# Altium project LCD_controller_hv2.PrjPcb
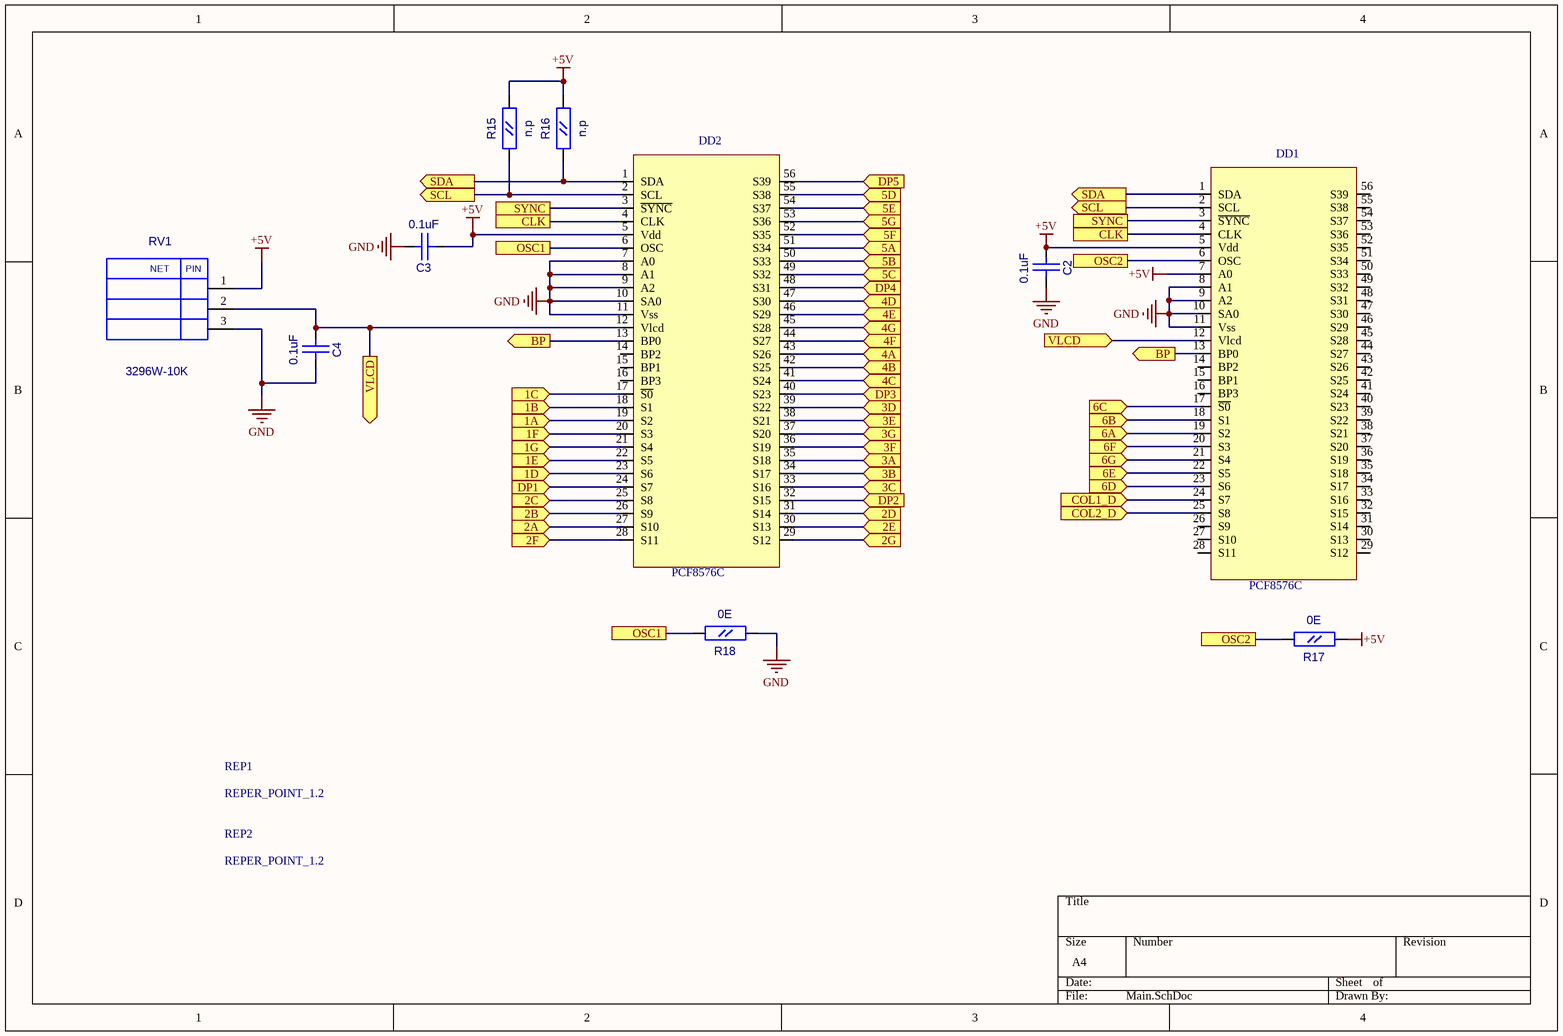
[diagram p0: Main.SchDoc]
4 sheets, 40 parts. Net scope: flat (ports and power ports of the same name join across sheets).
Board file: LCD_controller_hv2.PcbDoc
Sheets:
  Main.SchDoc
  LCD.SchDoc
  Connections.SchDoc
  Heater.SchDoc

## Sheet Main.SchDoc
size A4

### Parts
C2  0.1uF  [CC0603]
C3  0.1uF  [CC0603]
C4  0.1uF  [CC0603]
DD1  PCF8576C  [SOT190-1]
DD2  PCF8576C  [SOT190-1]
R15  n.p  [RC0603]
R16  n.p  [RC0603]
R17  0E  [RC0603]
R18  0E  [RC0603]
REP1  REPER_POINT_1.2  [REPER1.2]
REP2  REPER_POINT_1.2  [REPER1.2]
RV1  3296W-10K  [PLS-03]

### Ports
1A (in), 1B (in), 1C (in), 1D (in), 1E (in), 1F (in), 1G (in), 2A (in), 2B (in), 2C (in), 2D (in), 2E (in), 2F (in), 2G (in), 3A (in), 3B (in), 3C (in), 3D (in), 3E (in), 3F (in), 3G (in), 4A (in), 4B (in), 4C (in), 4D (in), 4E (in), 4F (in), 4G (in), 5A (in), 5B (in), 5C (in), 5D (in), 5E (in), 5F (in), 5G (in), 6A (in), 6B (in), 6C (in), 6D (in), 6E (in), 6F (in), 6G (in), BP (out), CLK, COL1_D (in), COL2_D (in), DP1 (in), DP2 (in), DP3 (in), DP4 (in), DP5 (in), OSC1, OSC2, SCL (out), SDA (out), SYNC, VLCD (in), VLCD (out)

### Nets
+5V: C2.1(A) C3.1(A) DD1.5(Vdd) DD1.7(A0) DD2.5(Vdd) R15.2(B) R16.2(B) R17.1(A) RV1.1
GND: C2.2(B) C3.2(B) C4.2(B) DD1.8(A1) DD1.9(A2) DD1.10(SA0) DD1.11(Vss) DD2.7(A0) DD2.8(A1) DD2.9(A2) DD2.10(SA0) DD2.11(Vss) R18.1(A) RV1.3
1A: DD2.19(S2) ; port 1A
1B: DD2.18(S1) ; port 1B
1C: DD2.17(~{S0}) ; port 1C
1D: DD2.23(S6) ; port 1D
1E: DD2.22(S5) ; port 1E
1F: DD2.20(S3) ; port 1F
1G: DD2.21(S4) ; port 1G
2A: DD2.27(S10) ; port 2A
2B: DD2.26(S9) ; port 2B
2C: DD2.25(S8) ; port 2C
2D: DD2.31(S14) ; port 2D
2E: DD2.30(S13) ; port 2E
2F: DD2.28(S11) ; port 2F
2G: DD2.29(S12) ; port 2G
3A: DD2.35(S18) ; port 3A
3B: DD2.34(S17) ; port 3B
3C: DD2.33(S16) ; port 3C
3D: DD2.39(S22) ; port 3D
3E: DD2.38(S21) ; port 3E
3F: DD2.36(S19) ; port 3F
3G: DD2.37(S20) ; port 3G
4A: DD2.43(S26) ; port 4A
4B: DD2.42(S25) ; port 4B
4C: DD2.41(S24) ; port 4C
4D: DD2.47(S30) ; port 4D
4E: DD2.46(S29) ; port 4E
4F: DD2.44(S27) ; port 4F
4G: DD2.45(S28) ; port 4G
5A: DD2.51(S34) ; port 5A
5B: DD2.50(S33) ; port 5B
5C: DD2.49(S32) ; port 5C
5D: DD2.55(S38) ; port 5D
5E: DD2.54(S37) ; port 5E
5F: DD2.52(S35) ; port 5F
5G: DD2.53(S36) ; port 5G
6A: DD1.19(S2) ; port 6A
6B: DD1.18(S1) ; port 6B
6C: DD1.17(~{S0}) ; port 6C
6D: DD1.23(S6) ; port 6D
6E: DD1.22(S5) ; port 6E
6F: DD1.20(S3) ; port 6F
6G: DD1.21(S4) ; port 6G
BP: DD1.13(BP0) DD2.13(BP0) ; port BP
COL1: DD1.24(S7) ; port COL1_D
COL2: DD1.25(S8) ; port COL2_D
DP: DD2.24(S7) ; port DP1
DP2: DD2.32(S15) ; port DP2
DP3: DD2.40(S23) ; port DP3
DP4: DD2.48(S31) ; port DP4
DP5: DD2.56(S39) ; port DP5
NetC4_1: C4.1(A) DD1.12(Vlcd) DD2.12(Vlcd) RV1.2 ; port VLCD
NetDD1_1: DD1.1(SDA) DD2.1(SDA) R16.1(A) ; port SDA
NetDD1_2: DD1.2(SCL) DD2.2(SCL) R15.1(A) ; port SCL
NetDD1_3: DD1.3(~{SYNC}) DD2.3(~{SYNC}) ; port SYNC
NetDD1_4: DD1.4(CLK) DD2.4(CLK) ; port CLK
NetDD1_6: DD1.6(OSC) R17.2(B) ; port OSC2
NetDD2_6: DD2.6(OSC) R18.2(B) ; port OSC1

Not connected (* = marked no-connect by the designer): DD1 14(BP2) 15(BP1) 16(BP3) 26(S9) 27(S10) 28(S11) 29(S12) 30(S13) 31(S14) 32(S15) 33(S16) 34(S17) 35(S18) 36(S19) 37(S20) 38(S21) 39(S22) 40(S23) 41(S24) 42(S25) 43(S26) 44(S27) 45(S28) 46(S29) 47(S30) 48(S31) 49(S32) 50(S33) 51(S34) 52(S35) 53(S36) 54(S37) 55(S38) 56(S39); DD2 14(BP2) 15(BP1) 16(BP3); REP1 1; REP2 1

### Library data of the parts
C2-C4 = CC0603: Value: 0.1uF
DD1 DD2 = PCF8576: LCD Controller; Value: PCF8576C
R15-R18 = RC0603
  R15 R16: Value: n.p
  R17 R18: Value: 0E
REP1 REP2 = REPER1.2: Value: REPER_POINT_1.2
RV1 = PLS03: Value: *

## Sheet LCD.SchDoc
size A4
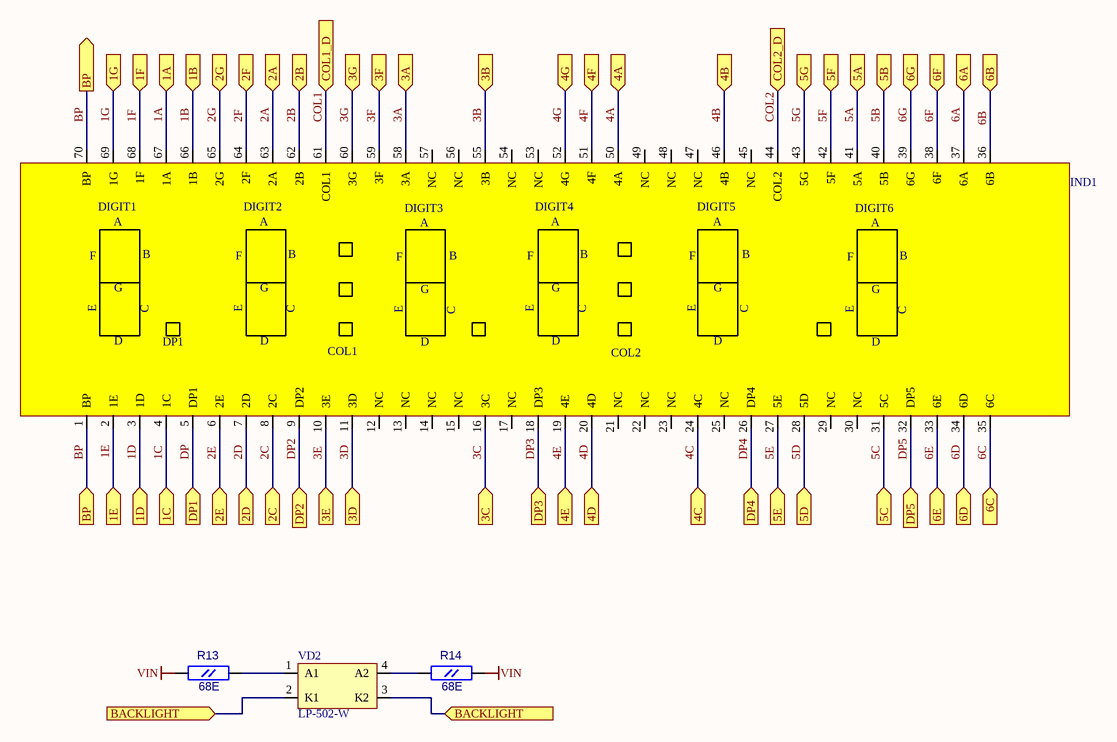
[diagram p1: LCD.SchDoc]

### Parts
IND1  DE156  [IND_DE156]  (value not drawn)
R13  68E  [RC0603]
R14  68E  [RC0603]
VD2  LP-502-W  [LP-502-W]

### Ports
1A (in), 1B (in), 1C (in), 1D (in), 1E (in), 1F (in), 1G (in), 2A (in), 2B (in), 2C (in), 2D (in), 2E (in), 2F (in), 2G (in), 3A (in), 3B (in), 3C (in), 3D (in), 3E (in), 3F (in), 3G (in), 4A (in), 4B (in), 4C (in), 4D (in), 4E (in), 4F (in), 4G (in), 5A (in), 5B (in), 5C (in), 5D (in), 5E (in), 5F (in), 5G (in), 6A (in), 6B (in), 6C (in), 6D (in), 6E (in), 6F (in), 6G (in), BACKLIGHT (in), BP (in), BP (out), COL1_D (in), COL2_D (in), DP1 (in), DP2 (in), DP3 (in), DP4 (in), DP5 (in)

### Nets
VIN: R13.1(A) R14.2(B)
1A: IND1.67(1A) ; port 1A
1B: IND1.66(1B) ; port 1B
1C: IND1.4(1C) ; port 1C
1D: IND1.3(1D) ; port 1D
1E: IND1.2(1E) ; port 1E
1F: IND1.68(1F) ; port 1F
1G: IND1.69(1G) ; port 1G
2A: IND1.63(2A) ; port 2A
2B: IND1.62(2B) ; port 2B
2C: IND1.8(2C) ; port 2C
2D: IND1.7(2D) ; port 2D
2E: IND1.6(2E) ; port 2E
2F: IND1.64(2F) ; port 2F
2G: IND1.65(2G) ; port 2G
3A: IND1.58(3A) ; port 3A
3B: IND1.55(3B) ; port 3B
3C: IND1.16(3C) ; port 3C
3D: IND1.11(3D) ; port 3D
3E: IND1.10(3E) ; port 3E
3F: IND1.59(3F) ; port 3F
3G: IND1.60(3G) ; port 3G
4A: IND1.50(4A) ; port 4A
4B: IND1.46(4B) ; port 4B
4C: IND1.24(4C) ; port 4C
4D: IND1.20(4D) ; port 4D
4E: IND1.19(4E) ; port 4E
4F: IND1.51(4F) ; port 4F
4G: IND1.52(4G) ; port 4G
5A: IND1.41(5A) ; port 5A
5B: IND1.40(5B) ; port 5B
5C: IND1.31(5C) ; port 5C
5D: IND1.28(5D) ; port 5D
5E: IND1.27(5E) ; port 5E
5F: IND1.42(5F) ; port 5F
5G: IND1.43(5G) ; port 5G
6A: IND1.37(6A) ; port 6A
6B: IND1.36(6B) ; port 6B
6C: IND1.35(6C) ; port 6C
6D: IND1.34(6D) ; port 6D
6E: IND1.33(6E) ; port 6E
6F: IND1.38(6F) ; port 6F
6G: IND1.39(6G) ; port 6G
BL: VD2.2(K1) VD2.3(K2) ; port BACKLIGHT
BP: IND1.1(BP) IND1.70(BP) ; port BP
COL1: IND1.61(COL1) ; port COL1_D
COL2: IND1.44(COL2) ; port COL2_D
DP: IND1.5(DP1) ; port DP1
DP2: IND1.9(DP2) ; port DP2
DP3: IND1.18(DP3) ; port DP3
DP4: IND1.26(DP4) ; port DP4
DP5: IND1.32(DP5) ; port DP5
NetR13_2: R13.2(B) VD2.1(A1)
NetR14_1: R14.1(A) VD2.4(A2)

Not connected (* = marked no-connect by the designer): IND1 12(NC) 13(NC) 14(NC) 15(NC) 17(NC) 21(NC) 22(NC) 23(NC) 25(NC) 29(NC) 30(NC) 45(NC) 47(NC) 48(NC) 49(NC) 53(NC) 54(NC) 56(NC) 57(NC)

### Notes on the sheet
- (in symbol IND7_DE156) DIGIT1; DIGIT2; DIGIT3; DIGIT4; DIGIT5; DIGIT6; A; F; B; G; E; C; D

### Library data of the parts
IND1 = IND7_DE156: 6digit 7Segment indicator; Value: DE156
R13 R14 = RC0603: Value: 68E
VD2 = LP-502-W: Backlight for lcd display; Value: LP-502-W

## Sheet Connections.SchDoc
size A4
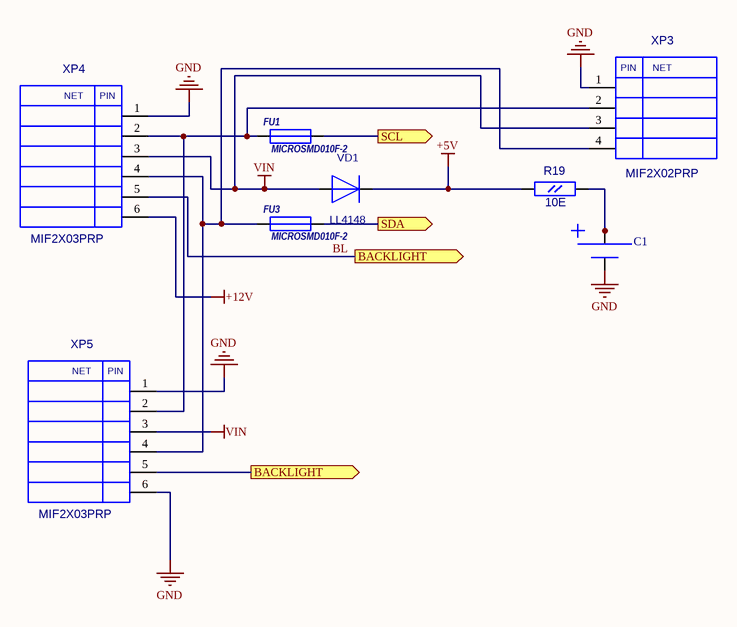
[diagram p2: Connections.SchDoc]

### Parts
C1  EEC-S5R5H105  [CR2032_ONBOARD]  (value not drawn)
FU1  MICROSMD010F-2  [RC1210]
FU3  MICROSMD010F-2  [RC1210]
R19  10E  [RC0603]
VD1  LL4148  [SOD-80]
XP3  MIF2X02PRP  [MIF2X02PRP]
XP4  MIF2X03PRP  [MIF2X03PRP]
XP5  MIF2X03PRP  [MIF2X03PRP]

### Ports
BACKLIGHT (out), SCL (out), SDA (out)

### Nets
+5V: R19.1(A) VD1.2(+)
+12V: XP4.6
GND: C1.1 XP3.1 XP4.1 XP5.1 XP5.6
VIN: VD1.1(-) XP3.3 XP4.3 XP5.3
BL: XP4.5 XP5.5 ; port BACKLIGHT
NetC1_2: C1.2 C1.3 C1.4 R19.2(B)
NetDD1_1: FU3.2 ; port SDA
NetDD1_2: FU1.2 ; port SCL
NetFU1_1: FU1.1 XP3.2 XP4.2 XP5.2
NetFU3_1: FU3.1 XP3.4 XP4.4 XP5.4

### Notes on the sheet
- (in symbol MIF2X02PRP) PIN; NET
- (in symbol MIF2X03PRP) NET; PIN

### Library data of the parts
C1 = CR2032-VBY2: Value: EEC-S5R5H105
FU1 FU3 = MICROSMD: Value: MICROSMD010F-2
R19 = RC0603: Value: 10E
VD1 = LL4148: Value: *
XP3 = MIF2X02PRP: Value: MIF2X02PRP
XP4 XP5 = MIF2X03PRP: Value: *

## Sheet Heater.SchDoc
size A4
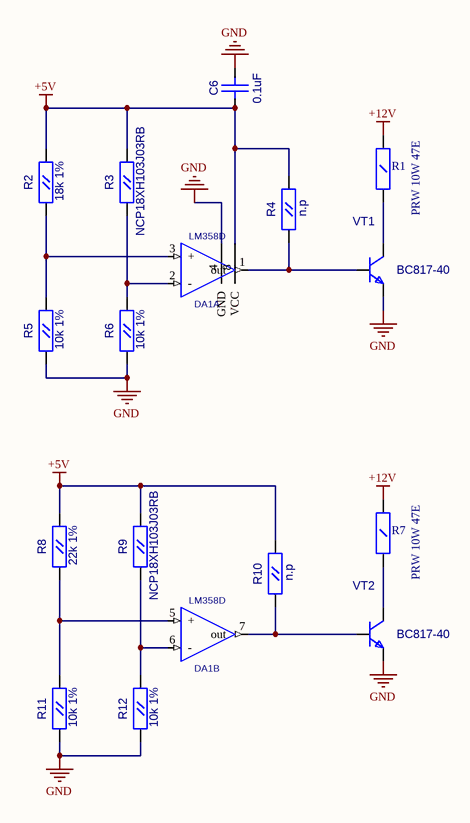
[diagram p3: Heater.SchDoc]

### Parts
C6  0.1uF  [CC0603]
DA1  LM358D  [SO-8]  (parts A,B of 2)
R1  PRW 10W 47E  [R_5W_Cement]
R2  18k 1%  [RC0603]
R3  NCP18XH103J03RB  [RC0603]
R4  n.p  [RC0603]
R5  10k 1%  [RC0603]
R6  10k 1%  [RC0603]
R7  PRW 10W 47E  [R_5W_Cement]
R8  22k 1%  [RC0603]
R9  NCP18XH103J03RB  [RC0603]
R10  n.p  [RC0603]
R11  10k 1%  [RC0603]
R12  10k 1%  [RC0603]
VT1  BC817-40  [SOT-23(123)]
VT2  BC817-40  [SOT-23(123)]

### Nets
+5V: C6.1(A) DA1.8(VCC) R2.2(B) R3.2(B) R4.2(B) R8.2(B) R9.2(B) R10.2(B)
+12V: R1.2(B) R7.2(B)
GND: C6.2(B) DA1.4(GND) R5.1(A) R6.1(A) R11.1(A) R12.1(A) VT1.2(E) VT2.2(E)
NetDA1_1: DA1.1(out) R4.1(A) VT1.1(B)
NetDA1_2: DA1.2(-) R3.1(A) R6.2(B)
NetDA1_3: DA1.3(+) R2.1(A) R5.2(B)
NetDA1_5: DA1.5(+) R8.1(A) R11.2(B)
NetDA1_6: DA1.6(-) R9.1(A) R12.2(B)
NetDA1_7: DA1.7(out) R10.1(A) VT2.1(B)
NetR1_1: R1.1(A) VT1.3(C)
NetR7_1: R7.1(A) VT2.3(C)

### Library data of the parts
C6 = CC0603: Value: 0.1uF
R1 R7 = R_10W: Value: PRW 10W 47E
R2-R6 R8-R12 = RC0603
  R2: Value: 18k 1%
  R3 R9: Value: NCP18XH103J03RB
  R4 R10: Value: n.p
  R5 R6 R11 R12: Value: 10k 1%
  R8: Value: 22k 1%
VT1 VT2 = BC846BLT1: NPN 500ma transistor; ComponentField7: Published 29-Sep-2000; OriginalName: BC846BLT1; Value: BC817-40
DA1 = LM358D: Value: *

## Nets that join several sheets
+5V: Main (9 pins), Connections (R19.1 VD1.2), Heater (8 pins)
+12V: Connections (XP4.6), Heater (R1.2 R7.2)
GND: Main (14 pins), Connections (5 pins), Heater (8 pins)
VIN: LCD (R13.1 R14.2), Connections (VD1.1 XP3.3 XP4.3 XP5.3)
1A: Main (DD2.19), LCD (IND1.67)
1B: Main (DD2.18), LCD (IND1.66)
1C: Main (DD2.17), LCD (IND1.4)
1D: Main (DD2.23), LCD (IND1.3)
1E: Main (DD2.22), LCD (IND1.2)
1F: Main (DD2.20), LCD (IND1.68)
1G: Main (DD2.21), LCD (IND1.69)
2A: Main (DD2.27), LCD (IND1.63)
2B: Main (DD2.26), LCD (IND1.62)
2C: Main (DD2.25), LCD (IND1.8)
2D: Main (DD2.31), LCD (IND1.7)
2E: Main (DD2.30), LCD (IND1.6)
2F: Main (DD2.28), LCD (IND1.64)
2G: Main (DD2.29), LCD (IND1.65)
3A: Main (DD2.35), LCD (IND1.58)
3B: Main (DD2.34), LCD (IND1.55)
3C: Main (DD2.33), LCD (IND1.16)
3D: Main (DD2.39), LCD (IND1.11)
3E: Main (DD2.38), LCD (IND1.10)
3F: Main (DD2.36), LCD (IND1.59)
3G: Main (DD2.37), LCD (IND1.60)
4A: Main (DD2.43), LCD (IND1.50)
4B: Main (DD2.42), LCD (IND1.46)
4C: Main (DD2.41), LCD (IND1.24)
4D: Main (DD2.47), LCD (IND1.20)
4E: Main (DD2.46), LCD (IND1.19)
4F: Main (DD2.44), LCD (IND1.51)
4G: Main (DD2.45), LCD (IND1.52)
5A: Main (DD2.51), LCD (IND1.41)
5B: Main (DD2.50), LCD (IND1.40)
5C: Main (DD2.49), LCD (IND1.31)
5D: Main (DD2.55), LCD (IND1.28)
5E: Main (DD2.54), LCD (IND1.27)
5F: Main (DD2.52), LCD (IND1.42)
5G: Main (DD2.53), LCD (IND1.43)
6A: Main (DD1.19), LCD (IND1.37)
6B: Main (DD1.18), LCD (IND1.36)
6C: Main (DD1.17), LCD (IND1.35)
6D: Main (DD1.23), LCD (IND1.34)
6E: Main (DD1.22), LCD (IND1.33)
6F: Main (DD1.20), LCD (IND1.38)
6G: Main (DD1.21), LCD (IND1.39)
BL: LCD (VD2.2 VD2.3), Connections (XP4.5 XP5.5)
BP: Main (DD1.13 DD2.13), LCD (IND1.1 IND1.70)
COL1: Main (DD1.24), LCD (IND1.61)
COL2: Main (DD1.25), LCD (IND1.44)
DP: Main (DD2.24), LCD (IND1.5)
DP2: Main (DD2.32), LCD (IND1.9)
DP3: Main (DD2.40), LCD (IND1.18)
DP4: Main (DD2.48), LCD (IND1.26)
DP5: Main (DD2.56), LCD (IND1.32)
NetDD1_1: Main (DD1.1 DD2.1 R16.1), Connections (FU3.2)
NetDD1_2: Main (DD1.2 DD2.2 R15.1), Connections (FU1.2)